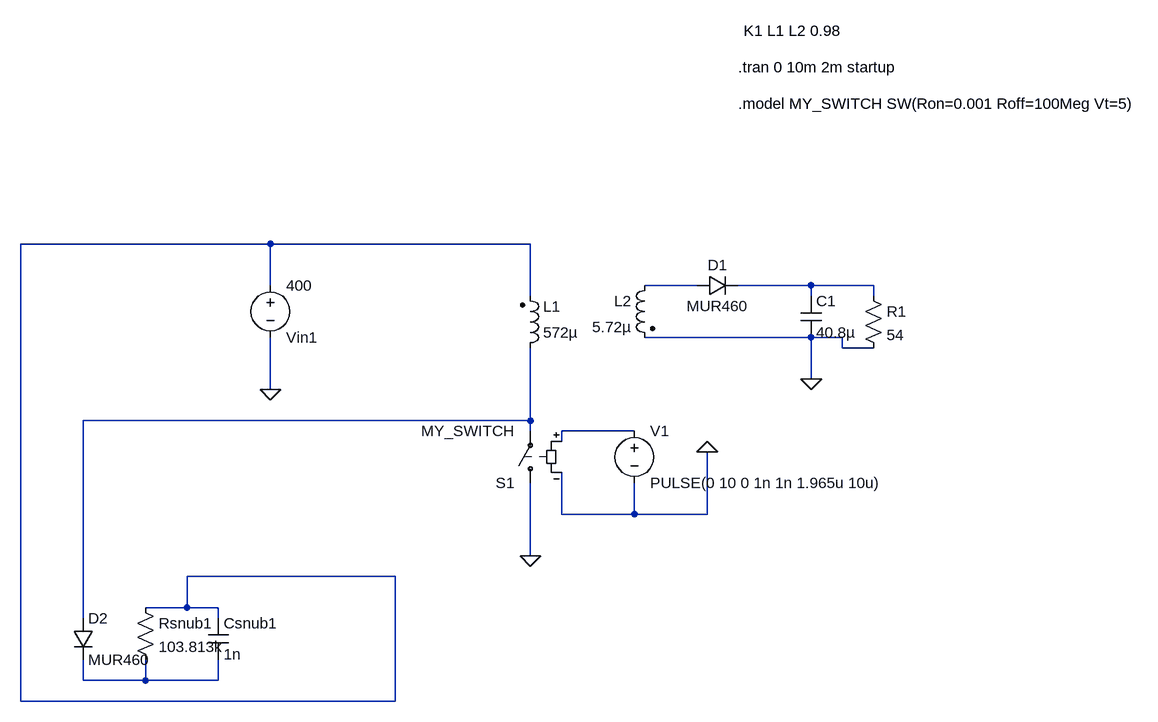
[diagram p0: schematic 25-06-26.asc]
25-06-26.asc, the LTspice schematic file:
Version 4
SHEET 1 1124 680
WIRE -256 -80 -640 -80
WIRE 144 -80 -256 -80
WIRE -256 -16 -256 -80
WIRE 400 -16 320 -16
WIRE 576 -16 464 -16
WIRE 672 -16 576 -16
WIRE 144 0 144 -80
WIRE 576 0 576 -16
WIRE 672 0 672 -16
WIRE 576 64 320 64
WIRE 624 64 576 64
WIRE 624 80 624 64
WIRE 672 80 624 80
WIRE 576 128 576 64
WIRE -256 144 -256 64
WIRE 144 192 144 80
WIRE 144 192 -544 192
WIRE 144 208 144 192
WIRE 304 208 192 208
WIRE 192 224 192 208
WIRE 192 336 192 272
WIRE 304 336 304 288
WIRE 304 336 192 336
WIRE 416 336 416 240
WIRE 416 336 304 336
WIRE 144 400 144 288
WIRE -64 432 -384 432
WIRE -384 480 -384 432
WIRE -384 480 -448 480
WIRE -336 480 -384 480
WIRE -544 496 -544 192
WIRE -336 496 -336 480
WIRE -544 592 -544 560
WIRE -448 592 -448 560
WIRE -448 592 -544 592
WIRE -336 592 -336 560
WIRE -336 592 -448 592
WIRE -640 624 -640 -80
WIRE -64 624 -64 432
WIRE -64 624 -640 624
FLAG 576 128 0
FLAG 144 400 0
FLAG -256 144 0
FLAG 416 240 0
SYMBOL ind2 128 96 M180
WINDOW 0 36 80 Left 2
WINDOW 3 36 40 Left 2
SYMATTR InstName L1
SYMATTR Value 572µ
SYMATTR Type ind
SYMBOL ind2 336 -32 M0
SYMATTR InstName L2
SYMATTR Value 5.72µ
SYMATTR Type ind
SYMBOL diode 400 0 R270
WINDOW 0 32 32 VTop 2
WINDOW 3 0 32 VBottom 2
SYMATTR InstName D1
SYMATTR Value MUR460
SYMBOL cap 560 0 R0
SYMATTR InstName C1
SYMATTR Value 40.8µ
SYMBOL voltage -256 -32 R0
WINDOW 0 24 96 Left 2
WINDOW 3 24 16 Left 2
WINDOW 123 0 0 Left 0
WINDOW 39 0 0 Left 0
SYMATTR InstName Vin1
SYMATTR Value 400
SYMBOL res 656 -16 R0
SYMATTR InstName R1
SYMATTR Value 54
SYMBOL sw 144 304 R180
SYMATTR InstName S1
SYMATTR Value MY_SWITCH
SYMBOL voltage 304 192 R0
SYMATTR InstName V1
SYMATTR Value PULSE(0 10 0 1n 1n 1.965u 10u)
SYMBOL diode -560 496 R0
SYMATTR InstName D2
SYMATTR Value MUR460
SYMBOL res -464 464 R0
SYMATTR InstName Rsnub1
SYMATTR Value 103.813k
SYMBOL cap -352 496 R0
SYMATTR InstName Csnub1
SYMATTR Value 1n
TEXT 472 -408 Left 2 !K1 L1 L2 0.98
TEXT 464 -352 Left 2 !.tran 0 10m 2m startup
TEXT 464 -296 Left 2 !.model MY_SWITCH SW(Ron=0.001 Roff=100Meg Vt=5)

The netlist it stands for:
* 25-06-26.asc
L1 N004 N001 572µ
L2 N002 0 5.72µ
D1 N002 N003 MUR460
C1 N003 0 40.8µ
Vin1 N001 0 400
R1 N003 0 54
S1 0 N004 N005 0 MY_SWITCH
V1 N005 0 PULSE(0 10 0 1n 1n 1.965u 10u)
D2 N004 N006 MUR460
Rsnub1 N001 N006 103.813k
Csnub1 N001 N006 1n
.model D D
.lib standard.dio
K1 L1 L2 0.98
.tran 0 10m 2m startup
.model MY_SWITCH SW(Ron=0.001 Roff=100Meg Vt=5)
.backanno
.end